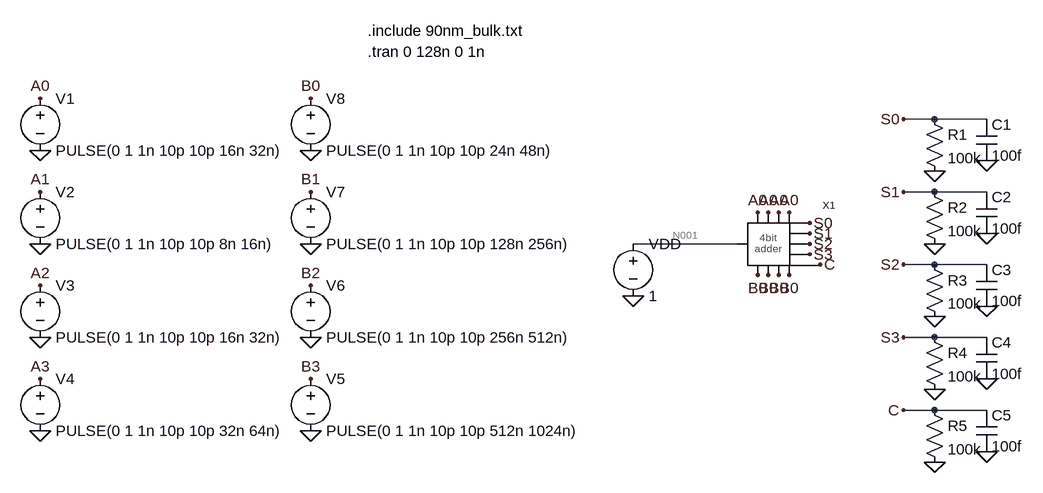
[diagram p0: schematic 4bit_adder_test2.asc]
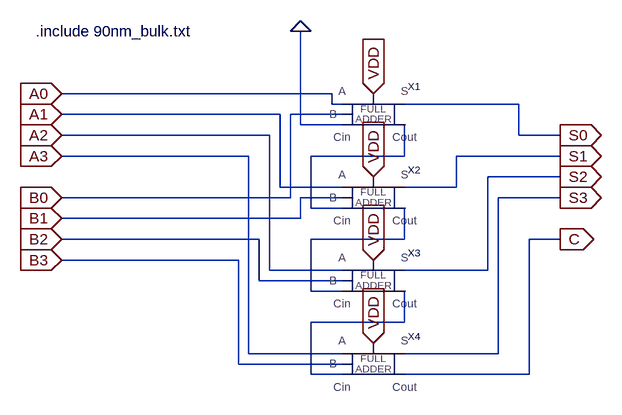
[diagram p1: sub-circuit 4bit_adder.asc]
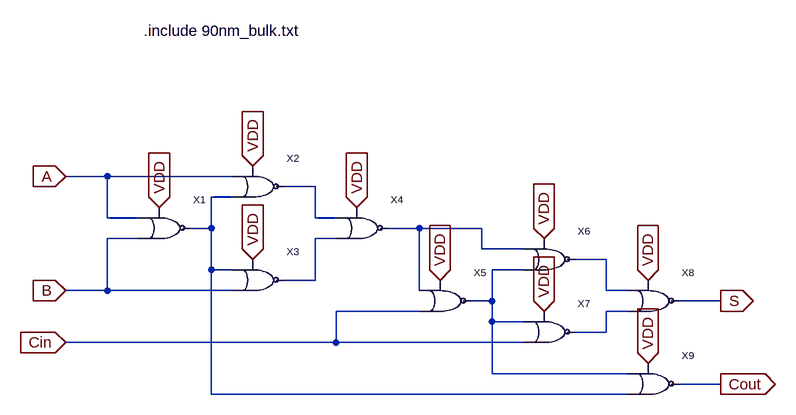
[diagram p2: sub-circuit full_adder.asc]
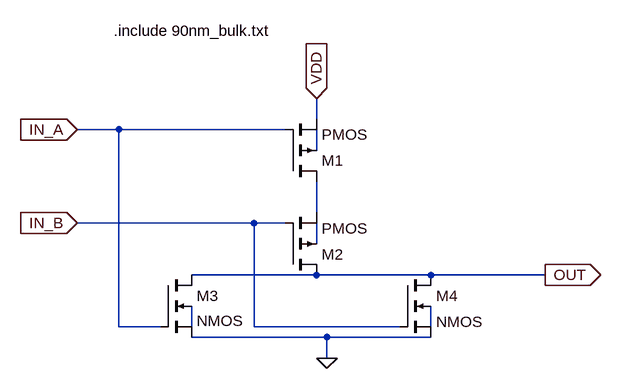
[diagram p3: sub-circuit nor.asc]
4bit_adder_test2.asc, the LTspice schematic file:
Version 4
SHEET 1 880 680
WIRE 448 -48 400 -48
WIRE 528 -48 448 -48
WIRE 448 64 400 64
WIRE 528 64 448 64
WIRE 144 144 -16 144
WIRE 448 176 400 176
WIRE 528 176 448 176
WIRE 448 288 400 288
WIRE 528 288 448 288
WIRE 448 400 400 400
WIRE 528 400 448 400
FLAG -16 224 0
FLAG -928 0 0
FLAG -928 144 0
FLAG -928 288 0
FLAG -928 432 0
FLAG -512 432 0
FLAG -512 288 0
FLAG -512 144 0
FLAG -512 0 0
FLAG -928 -80 A0
FLAG 224 96 A0
FLAG -928 64 A1
FLAG 208 96 A0
FLAG -928 208 A2
FLAG -928 352 A3
FLAG -512 352 B3
FLAG -512 208 B2
FLAG -512 64 B1
FLAG -512 -80 B0
FLAG 176 96 A0
FLAG 192 96 A0
FLAG 176 192 B0
FLAG 192 192 B0
FLAG 208 192 B0
FLAG 224 192 B0
FLAG 448 32 0
FLAG 528 16 0
FLAG 448 144 0
FLAG 528 128 0
FLAG 448 256 0
FLAG 528 240 0
FLAG 448 368 0
FLAG 528 352 0
FLAG 448 480 0
FLAG 528 464 0
FLAG 400 -48 S0
FLAG 256 112 S0
FLAG 256 128 S1
FLAG 256 144 S2
FLAG 256 160 S3
FLAG 272 176 C
FLAG 400 64 S1
FLAG 400 176 S2
FLAG 400 288 S3
FLAG 400 400 C
SYMBOL 4bit_adder 192 144 R0
SYMATTR InstName X1
SYMBOL voltage -16 128 R0
WINDOW 123 0 0 Left 0
WINDOW 39 0 0 Left 0
SYMATTR InstName VDD
SYMATTR Value 1
SYMBOL voltage -928 -96 R0
WINDOW 123 0 0 Left 0
WINDOW 39 0 0 Left 0
SYMATTR InstName V1
SYMATTR Value PULSE(0 1 1n 10p 10p 16n 32n)
SYMBOL voltage -928 48 R0
WINDOW 123 0 0 Left 0
WINDOW 39 0 0 Left 0
SYMATTR InstName V2
SYMATTR Value PULSE(0 1 1n 10p 10p 8n 16n)
SYMBOL voltage -928 192 R0
WINDOW 123 0 0 Left 0
WINDOW 39 0 0 Left 0
SYMATTR InstName V3
SYMATTR Value PULSE(0 1 1n 10p 10p 16n 32n)
SYMBOL voltage -928 336 R0
WINDOW 123 0 0 Left 0
WINDOW 39 0 0 Left 0
SYMATTR InstName V4
SYMATTR Value PULSE(0 1 1n 10p 10p 32n 64n)
SYMBOL voltage -512 336 R0
WINDOW 123 0 0 Left 0
WINDOW 39 0 0 Left 0
SYMATTR InstName V5
SYMATTR Value PULSE(0 1 1n 10p 10p 512n 1024n)
SYMBOL voltage -512 192 R0
WINDOW 123 0 0 Left 0
WINDOW 39 0 0 Left 0
SYMATTR InstName V6
SYMATTR Value PULSE(0 1 1n 10p 10p 256n 512n)
SYMBOL voltage -512 48 R0
WINDOW 123 0 0 Left 0
WINDOW 39 0 0 Left 0
SYMATTR InstName V7
SYMATTR Value PULSE(0 1 1n 10p 10p 128n 256n)
SYMBOL voltage -512 -96 R0
WINDOW 123 0 0 Left 0
WINDOW 39 0 0 Left 0
SYMATTR InstName V8
SYMATTR Value PULSE(0 1 1n 10p 10p 24n 48n)
SYMBOL res 432 -64 R0
SYMATTR InstName R1
SYMATTR Value 100k
SYMBOL res 432 48 R0
SYMATTR InstName R2
SYMATTR Value 100k
SYMBOL res 432 160 R0
SYMATTR InstName R3
SYMATTR Value 100k
SYMBOL res 432 272 R0
SYMATTR InstName R4
SYMATTR Value 100k
SYMBOL res 432 384 R0
SYMATTR InstName R5
SYMATTR Value 100k
SYMBOL cap 512 -48 R0
SYMATTR InstName C1
SYMATTR Value 100f
SYMBOL cap 512 64 R0
SYMATTR InstName C2
SYMATTR Value 100f
SYMBOL cap 512 176 R0
SYMATTR InstName C3
SYMATTR Value 100f
SYMBOL cap 512 288 R0
SYMATTR InstName C4
SYMATTR Value 100f
SYMBOL cap 512 400 R0
SYMATTR InstName C5
SYMATTR Value 100f
TEXT -424 -184 Left 2 !.include 90nm_bulk.txt
TEXT -424 -152 Left 2 !.tran 0 128n 0 1n

4bit_adder.asc, the sub-circuit schematic file:
Version 4
SHEET 1 880 680
WIRE -224 48 -640 48
WIRE -224 64 -224 48
WIRE -208 64 -224 64
WIRE 64 64 -112 64
WIRE -304 80 -640 80
WIRE -208 80 -288 80
WIRE -272 96 -272 -48
WIRE -208 96 -272 96
WIRE -320 112 -640 112
WIRE 64 112 64 64
WIRE 128 112 64 112
WIRE -352 144 -640 144
WIRE -112 144 -112 96
WIRE -112 144 -256 144
WIRE 128 144 -32 144
WIRE 128 176 16 176
WIRE -304 192 -304 80
WIRE -208 192 -304 192
WIRE -32 192 -32 144
WIRE -32 192 -112 192
WIRE -288 208 -288 80
WIRE -288 208 -640 208
WIRE -208 208 -272 208
WIRE 128 208 32 208
WIRE -256 224 -256 144
WIRE -208 224 -256 224
WIRE -272 240 -272 208
WIRE -272 240 -640 240
WIRE -336 272 -640 272
WIRE -112 272 -112 224
WIRE -112 272 -256 272
WIRE 128 272 80 272
WIRE -368 304 -640 304
WIRE -320 320 -320 112
WIRE -208 320 -320 320
WIRE 16 320 16 176
WIRE 16 320 -112 320
WIRE -336 336 -336 272
WIRE -208 336 -336 336
WIRE -256 352 -256 272
WIRE -208 352 -256 352
WIRE -112 400 -112 352
WIRE -112 400 -256 400
WIRE -352 448 -352 144
WIRE -208 448 -352 448
WIRE 32 448 32 208
WIRE 32 448 -112 448
WIRE -368 464 -368 304
WIRE -208 464 -368 464
WIRE -256 480 -256 400
WIRE -208 480 -256 480
WIRE 80 480 80 272
WIRE 80 480 -112 480
FLAG -160 48 VDD
IOPIN -160 48 In
FLAG -160 176 VDD
IOPIN -160 176 In
FLAG -160 304 VDD
IOPIN -160 304 In
FLAG -160 432 VDD
IOPIN -160 432 In
FLAG -640 48 A0
IOPIN -640 48 In
FLAG -640 80 A1
IOPIN -640 80 In
FLAG -640 112 A2
IOPIN -640 112 In
FLAG -640 144 A3
IOPIN -640 144 In
FLAG -640 208 B0
IOPIN -640 208 In
FLAG -640 240 B1
IOPIN -640 240 In
FLAG -640 272 B2
IOPIN -640 272 In
FLAG -640 304 B3
IOPIN -640 304 In
FLAG 128 112 S0
IOPIN 128 112 Out
FLAG 128 144 S1
IOPIN 128 144 Out
FLAG 128 176 S2
IOPIN 128 176 Out
FLAG 128 208 S3
IOPIN 128 208 Out
FLAG 128 272 C
IOPIN 128 272 Out
FLAG -272 -48 0
SYMBOL full_adder -160 80 R0
SYMATTR InstName X1
SYMBOL full_adder -160 208 R0
SYMATTR InstName X2
SYMBOL full_adder -160 336 R0
SYMATTR InstName X3
SYMBOL full_adder -160 464 R0
SYMATTR InstName X4
TEXT -680 -48 Left 2 !.include 90nm_bulk.txt

full_adder.asc, the sub-circuit schematic file:
Version 4
SHEET 1 880 680
WIRE -464 0 -528 0
WIRE -272 0 -464 0
WIRE -144 16 -192 16
WIRE -272 32 -304 32
WIRE -464 64 -464 0
WIRE -416 64 -464 64
WIRE -144 64 -144 16
WIRE -112 64 -144 64
WIRE -304 80 -304 32
WIRE -304 80 -336 80
WIRE 16 80 -32 80
WIRE 112 80 16 80
WIRE -416 96 -464 96
WIRE -112 96 -144 96
WIRE 112 112 112 80
WIRE 176 112 112 112
WIRE 304 128 256 128
WIRE -304 144 -304 80
WIRE -272 144 -304 144
WIRE 176 144 128 144
WIRE -144 160 -144 96
WIRE -144 160 -192 160
WIRE -464 176 -464 96
WIRE -464 176 -528 176
WIRE -272 176 -464 176
WIRE 16 176 16 80
WIRE 304 176 304 128
WIRE 336 176 304 176
WIRE 128 192 128 144
WIRE 128 192 96 192
WIRE 480 192 416 192
WIRE 16 208 -112 208
WIRE 336 208 304 208
WIRE 128 224 128 192
WIRE 176 224 128 224
WIRE 304 240 304 208
WIRE 304 240 256 240
WIRE -112 256 -112 208
WIRE -112 256 -528 256
WIRE 176 256 -112 256
WIRE 128 304 128 224
WIRE 336 304 128 304
WIRE 480 320 416 320
WIRE -304 336 -304 144
WIRE 336 336 -304 336
FLAG -528 0 A
IOPIN -528 0 In
FLAG -528 176 B
IOPIN -528 176 In
FLAG -528 256 Cin
IOPIN -528 256 In
FLAG 480 192 S
IOPIN 480 192 Out
FLAG 480 320 Cout
IOPIN 480 320 Out
FLAG -384 48 VDD
IOPIN -384 48 In
FLAG -240 -16 VDD
IOPIN -240 -16 In
FLAG -240 128 VDD
IOPIN -240 128 In
FLAG -80 48 VDD
IOPIN -80 48 In
FLAG 48 160 VDD
IOPIN 48 160 In
FLAG 208 96 VDD
IOPIN 208 96 In
FLAG 208 208 VDD
IOPIN 208 208 In
FLAG 368 160 VDD
IOPIN 368 160 In
FLAG 368 288 VDD
IOPIN 368 288 In
SYMBOL nor -384 80 R0
SYMATTR InstName X1
SYMBOL nor -240 16 R0
SYMATTR InstName X2
SYMBOL nor -240 160 R0
SYMATTR InstName X3
SYMBOL nor -80 80 R0
SYMATTR InstName X4
SYMBOL nor 48 192 R0
SYMATTR InstName X5
SYMBOL nor 208 128 R0
SYMATTR InstName X6
SYMBOL nor 208 240 R0
SYMATTR InstName X7
SYMBOL nor 368 192 R0
SYMATTR InstName X8
SYMBOL nor 368 320 R0
SYMATTR InstName X9
TEXT -408 -224 Left 2 !.include 90nm_bulk.txt

nor.asc, the sub-circuit schematic file:
Version 4
SHEET 1 880 680
WIRE 144 80 144 48
WIRE -160 96 -224 96
WIRE 96 96 -160 96
WIRE 144 128 144 96
WIRE 144 224 144 176
WIRE 48 240 -224 240
WIRE 96 240 48 240
WIRE 144 272 144 240
WIRE 144 320 -48 320
WIRE 320 320 144 320
WIRE 496 320 320 320
WIRE -160 400 -160 96
WIRE -96 400 -160 400
WIRE -48 400 -48 368
WIRE 48 400 48 240
WIRE 272 400 48 400
WIRE 320 400 320 368
WIRE 160 416 -48 416
WIRE 320 416 160 416
WIRE 160 448 160 416
FLAG 160 448 0
FLAG -224 96 IN_A
IOPIN -224 96 In
FLAG -224 240 IN_B
IOPIN -224 240 In
FLAG 144 48 VDD
IOPIN 144 48 In
FLAG 496 320 OUT
IOPIN 496 320 Out
SYMBOL pmos4 96 176 M180
SYMATTR InstName M1
SYMATTR Value2 l=90n w=400n
SYMBOL pmos4 96 320 M180
SYMATTR InstName M2
SYMATTR Value2 l=90n w=400n
SYMBOL nmos4 -96 320 R0
WINDOW 3 56 71 Left 2
SYMATTR InstName M3
SYMATTR Value2 l=90n w=200n
SYMBOL nmos4 272 320 R0
SYMATTR InstName M4
SYMATTR Value2 l=90n w=200n
TEXT -168 -56 Left 2 !.include 90nm_bulk.txt

The netlist it stands for:
* 4bit_adder_test2.asc
XX1 A0 A0 A0 A0 B0 B0 B0 B0 N001 S0 S1 S2 S3 C 4bit_adder
VDD N001 0 1
V1 A0 0 PULSE(0 1 1n 10p 10p 16n 32n)
V2 A1 0 PULSE(0 1 1n 10p 10p 8n 16n)
V3 A2 0 PULSE(0 1 1n 10p 10p 16n 32n)
V4 A3 0 PULSE(0 1 1n 10p 10p 32n 64n)
V5 B3 0 PULSE(0 1 1n 10p 10p 512n 1024n)
V6 B2 0 PULSE(0 1 1n 10p 10p 256n 512n)
V7 B1 0 PULSE(0 1 1n 10p 10p 128n 256n)
V8 B0 0 PULSE(0 1 1n 10p 10p 24n 48n)
R1 S0 0 100k
R2 S1 0 100k
R3 S2 0 100k
R4 S3 0 100k
R5 C 0 100k
C1 S0 0 100f
C2 S1 0 100f
C3 S2 0 100f
C4 S3 0 100f
C5 C 0 100f

* block symbol definitions
.subckt 4bit_adder A0 A1 A2 A3 B0 B1 B2 B3 VDD S0 S1 S2 S3 C
XX1 A0 B0 0 VDD S0 N001 full_adder
XX2 A1 B1 N001 VDD S1 N002 full_adder
XX3 A2 B2 N002 VDD S2 N003 full_adder
XX4 A3 B3 N003 VDD S3 C full_adder
.include 90nm_bulk.txt
.ends 4bit_adder

.subckt full_adder A B Cin VDD S Cout
XX1 A B N002 VDD nor
XX2 A N002 N001 VDD nor
XX3 N002 B N004 VDD nor
XX4 N001 N004 N003 VDD nor
XX5 N003 Cin N006 VDD nor
XX6 N003 N006 N005 VDD nor
XX7 N006 Cin N007 VDD nor
XX8 N005 N007 S VDD nor
XX9 N006 N002 Cout VDD nor
.include 90nm_bulk.txt
.ends full_adder

.subckt nor IN_A IN_B OUT VDD
M1 N002 IN_A VDD N001 PMOS l=90n w=400n
M2 OUT IN_B N002 N003 PMOS l=90n w=400n
M3 OUT IN_A 0 N004 NMOS l=90n w=200n
M4 OUT IN_B 0 N005 NMOS l=90n w=200n
.include 90nm_bulk.txt
.ends nor

.model NMOS NMOS
.model PMOS PMOS
.lib standard.mos
.include 90nm_bulk.txt
.tran 0 128n 0 1n
.backanno
.end

* Results of the author's LTspice run, read from the files saved beside the schematic
* Operating Point, zero values left out:
*   V(n001) = 1 V
*   V(s0) = 55.85 µV
*   V(s1) = 55.85 µV
*   V(s2) = 55.85 µV
*   V(s3) = 55.85 µV
*   V(c) = 55.86 µV
*   I(R1) = 558.5 pA
*   I(R2) = 558.5 pA
*   I(R3) = 558.5 pA
*   I(R4) = 558.5 pA
*   I(R5) = 558.6 pA
*   I(Vdd) = -1.463 µA
*   I(V1) = 534.3 pA
*   I(V8) = 522.6 pA
*   Ix(x1:A0) = -133.6 pA
*   Ix(x1:A1) = -133.6 pA
*   Ix(x1:A2) = -133.6 pA
*   Ix(x1:A3) = -133.6 pA
*   Ix(x1:B0) = -130.7 pA
*   Ix(x1:B1) = -130.7 pA
*   Ix(x1:B2) = -130.7 pA
*   Ix(x1:B3) = -130.7 pA
*   Ix(x1:VDD) = 1.463 µA
*   Ix(x1:S0) = -558.5 pA
*   Ix(x1:S1) = -558.5 pA
*   Ix(x1:S2) = -558.5 pA
*   Ix(x1:S3) = -558.5 pA
*   Ix(x1:C) = -558.6 pA
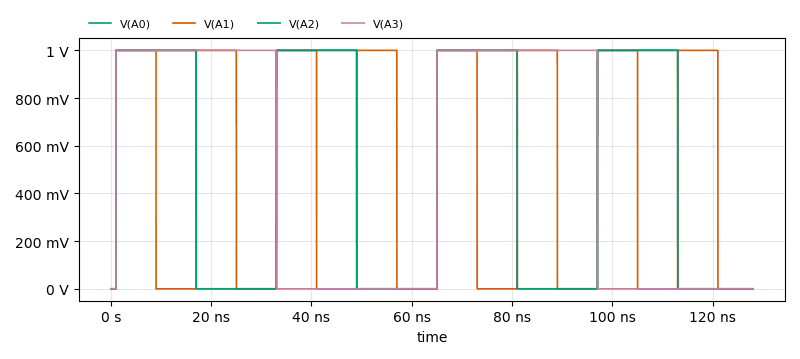
[diagram p4: Transient Analysis of 4bit_adder_test2.asc, plotted from the saved traces]
* Transient Analysis, 1 run:
*   V(A0): min 0 V, max 1 V, average 500.3 mV, rms 707.3 mV, last 0 V
*   V(A1): min 0 V, max 1 V, average 500.6 mV, rms 707.4 mV, last 0 V
*   V(A2): min 0 V, max 1 V, average 500.3 mV, rms 707.3 mV, last 0 V
*   V(A3): min 0 V, max 1 V, average 500.2 mV, rms 707.2 mV, last 0 V